# EasyEDA Pro project RCKid.epro, board Cartridge Connector
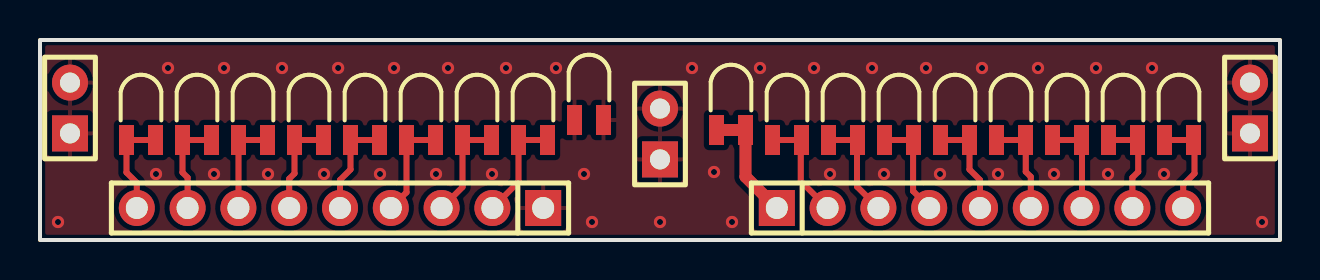
[diagram p21: board, top side]
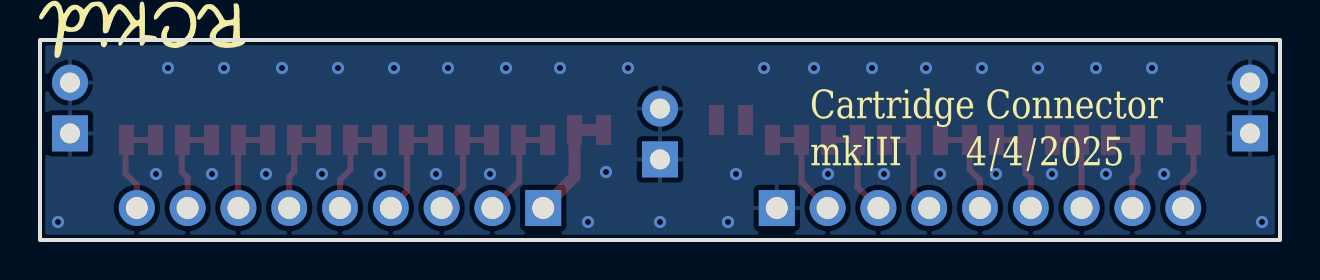
[diagram p22: board, bottom side, seen from below]

Outline 62 x 10 mm; copper layers: Top Layer, Bottom Layer. Coordinates in mm from the lower left corner of the outline.
Outline path: rectangle 0,10 62,0
Stack: Top Layer 0.035mm / Dielectric1 1.51mm FR4 er 4.5 / Bottom Layer 0.035mm

## Design rules (mm)
template: JLCPCB Capability(Two Layers Board)
spacing copperThickness1oz (default): track to track 0.102, other pairs 0.152 to 0.3
spacing copperThickness2oz: track to track 0.203, other pairs 0.152 to 0.3
track width copperThickness1oz (default): min 0.127, default 0.254, max 2.54
track width copperThickness2oz: min 0.203, default 0.254, max 2.54
differential pair differentialPair (default): width min 0.127, default 0.254, max 2.54; gap min 0.152, default 0.152
via viaSize (default): diameter min 0.5, default 0.61, max 10; hole min 0.3, default 0.305, max 6.3

## Placement (name value [footprint] x y rotation side)
CN1  2199248-6  [SMD_2199248-5]  5.05 5 90 top
CN2  2199248-6  [SMD_2199248-5]  7.85 5 90 top
CN3  2199248-6  [SMD_2199248-5]  10.65 5 90 top
CN4  2199248-6  [SMD_2199248-5]  13.45 5 90 top
CN5  2199248-6  [SMD_2199248-5]  16.25 5 90 top
CN6  2199248-6  [SMD_2199248-5]  19.05 5 90 top
CN7  2199248-6  [SMD_2199248-5]  21.85 5 90 top
CN8  2199248-6  [SMD_2199248-5]  24.65 5 90 top
CN9  2199248-6  [SMD_2199248-5]  27.45 6 90 top
CN10  2199248-6  [SMD_2199248-5]  34.55 5.5 90 top
CN11  2199248-6  [SMD_2199248-5]  37.35 5 90 top
CN12  2199248-6  [SMD_2199248-5]  40.15 5 90 top
CN13  2199248-6  [SMD_2199248-5]  42.95 5 90 top
CN14  2199248-6  [SMD_2199248-5]  45.75 5 90 top
CN15  2199248-6  [SMD_2199248-5]  48.55 5 90 top
CN16  2199248-6  [SMD_2199248-5]  51.35 5 90 top
CN17  2199248-6  [SMD_2199248-5]  54.15 5 90 top
CN18  2199248-6  [SMD_2199248-5]  56.95 5 90 top
H1  -  [HDR-TH_9P-P2.54-V-M]  15 1.6 180 top
H2  -  [HDR-TH_9P-P2.54-V-M]  47 1.6 0 top
H3  -  [HDR-TH_2P-P2.54-V-M-1]  31 5.3 90 top
H4  -  [HDR-TH_2P-P2.54-V-M-1]  1.5 6.6 90 top
H5  -  [HDR-TH_2P-P2.54-V-M-1]  60.5 6.6 90 top

## Footprints (pads in the part's own frame, mm; a bottom-side part is the same pattern mirrored in y, then rotated)
HDR-TH_2P-P2.54-V-M-1
  rect 1.8x1.8 hole 1x0.9: 1(-1.27,0)
  round 1.8 hole 1x0.9: 2(1.27,0)
HDR-TH_9P-P2.54-V-M
  rect 1.8x1.8 hole 1.1x0.9: 1(-10.16,0)
  round 1.8 hole 1.1x0.9: 2(-7.62,0) 3(-5.08,0) 4(-2.54,0) 5(0,0) 6(2.54,0) 7(5.08,0) 8(7.62,0) 9(10.16,0)
SMD_2199248-5
  rect 1.5x0.75 smd: 1(0,-0.725) 2(0,0.725)

## Nets
As in the schematic.

## Via types
v1: diameter 0.61, hole 0.305, Top Layer to Bottom Layer, 38 vias

## Routing (per net, layer and track width the routed paths; a pad name or vN(x,y) marks a point on that pad's centre or on a via; arc(x,y) is an arc through that point)
GND:
  vias: v1(0.9,0.9) v1(5.8,3.3) v1(6.4,8.6) v1(8.7,3.3) v1(9.2,8.6) v1(11.4,3.3) v1(12.1,8.6) v1(14.2,3.3) v1(14.91,8.6) v1(17,3.3) v1(17.7,8.6) v1(19.8,3.3) v1(20.4,8.6) v1(22.6,3.3) v1(23.3,8.6) v1(25.8,8.6) v1(27.2,3.3) v1(27.6,0.9) v1(31,0.9) v1(32.6,8.6) v1(33.7,3.4) v1(34.6,0.9) v1(36,8.6) v1(38.7,8.6) v1(39.5,3.3) v1(41.6,8.6) v1(42.2,3.3) v1(44.3,8.6) v1(45,3.3) v1(47.1,8.6) v1(47.9,3.3) v1(49.9,8.6) v1(50.7,3.3) v1(52.8,8.6) v1(53.4,3.3) v1(55.6,8.6) v1(56.2,3.3) v1(61.1,0.9)
$1N2052: length 5.1
  Top Layer w0.3: 5.78,5 CN1.2 4.33,3.38 4.84,2.86 H1.9
$1N2058: length 5
  Top Layer w0.3: H1.8 7.38,3.12 7.12,3.38 CN2.2 8.58,5
$1N2065: length 4.9
  Top Layer w0.3: H1.7 9.93,1.61 CN3.2 CN3.1
$1N2075: length 5
  Top Layer w0.3: 14.18,5 CN4.2 12.72,3.33 12.46,3.06 H1.6
$1N2082: length 5.1
  Top Layer w0.3: H1.5 15,3 15.53,3.53 CN5.2 CN5.1
$1N2087: length 5.2
  Top Layer w0.3: CN6.1 18.32,5 18.32,2.39 H1.4
$1N2094: length 5.3
  Top Layer w0.3: CN7.1 CN7.2 21.12,2.64 H1.3
$1N2101: length 5.4
  Top Layer w0.3: H1.2 23.93,2.91 CN8.2 CN8.1
$1N2108: length 5.1
  Top Layer w0.3: H2.9 57.16,2.76 57.72,3.33 57.72,5 ; CN18.2 57.68,5
$1N2118: length 5
  Top Layer w0.3: 54.91,5 54.91,3.41 54.62,3.12 H2.8 ; CN17.1 CN17.2
$1N2128: length 4.9
  Top Layer w0.3: 52.1,5 52.1,1.62 H2.7 ; CN16.1 CN16.2
$1N2135: length 5
  Top Layer w0.3: CN15.1 47.82,5 ; 49.29,5 49.29,3.41 49.54,3.16 H2.6
$1N2147: length 5.2
  Top Layer w0.3: 43.66,5 CN13.2 ; 43.66,5 43.66,2.44 44.46,1.64 H2.4 ; 43.66,5 43.68,5
$1N2154: length 5.3
  Top Layer w0.3: 40.85,5 40.85,2.67 H2.3 ; 40.85,5 CN12.2 ; 40.85,5 CN12.1
$1N2161: length 5.4
  Top Layer w0.3: CN11.1 38.04,5 ; 38.04,5 CN11.2 ; 38.04,5 38.04,2.94 H2.2
$1N2168: length 6
  Top Layer w0.6: H2.1 35.28,3.17 CN10.1 33.82,5.5
$1N7583: length 5.1
  Top Layer w0.3: H2.5 47,3 46.47,3.53 CN14.1 CN14.2

## Copper pours and planes (outline as drawn; the poured copper is in the pictures)
GND on Top Layer: 0,10 62,10 62,0 0,0
GND on Bottom Layer: 0,10 62,10 62,0 0,0

## Text on the board
Bottom Silkscreen Layer: Cartridge Connector / mkIII      4/4/2025
Top Silkscreen Layer: JLCJLCJLCJLC
